# Altium schematic sheet TM1637_display.SchDoc
size A4
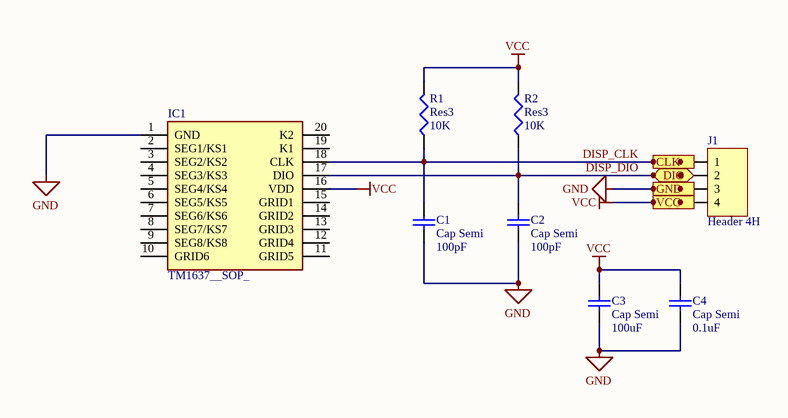
[diagram p0: TM1637_display.SchDoc]

## Parts
C1  Cap Semi  value 100pF  [1608[0603]]
C2  Cap Semi  value 100pF  [1608[0603]]
C3  Cap Semi  value 100uF  [1608[0603]]
C4  Cap Semi  value 0.1uF  [1608[0603]]
IC1  TM1637__SOP_  [SOIC127P1045X280-20N]
J1  Header 4H  [HDR1X4H]
R1  Res3  value 10K  [J1-0603]
R2  Res3  value 10K  [J1-0603]

## Ports
CLK (in), DIO (bidir), GND, VCC

## Nets
GND: C1.1 C2.1 C3.1 C4.1 IC1.1(GND) J1.3 ; port GND
VCC: C3.2 C4.2 IC1.16(VDD) J1.4 R1.2 R2.2 ; port VCC
DISP_CLK: C1.2 IC1.18(CLK) J1.1 R1.1 ; port CLK
DISP_DIO: C2.2 IC1.17(DIO) J1.2 R2.1 ; port DIO

Not connected (* = marked no-connect by the designer): IC1 2(SEG1/KS1) 3(SEG2/KS2) 4(SEG3/KS3) 5(SEG4/KS4) 6(SEG5/KS5) 7(SEG6/KS6) 8(SEG7/KS7) 9(SEG8/KS8) 10(GRID6) 11(GRID5) 12(GRID4) 13(GRID3) 14(GRID2) 15(GRID1) 19(K1) 20(K2)

## Library data of the parts
C1-C4 = Cap Semi: Capacitor (Semiconductor SIM Model); Published: 8-Jun-2000; LatestRevisionDate: 29-May-2009; LatestRevisionNote: IPC-7351 Footprint Added.; PackageReference: C1206; Publisher: Altium Limited; PackageDescription: Chip Capacitor
IC1 = TM1637__SOP_: Integrated Circuit; Manufacturer_Name: TITAN MICRO ELECTRONICS; Manufacturer_Part_Number: TM1637 (SOP); Datasheet Link: https://www.mcielectronics.cl/website_MCI/static/documents/Datasheet_TM1637.pdf; Height: 2.8mm
J1 = Header 4H: Header, 4-Pin, Right Angle; LatestRevisionDate: 17-Jul-2002; LatestRevisionNote: Re-released for DXP Platform.; Publisher: Altium Limited
R1 R2 = Res3: Resistor; Published: 8-Jun-2000; LatestRevisionDate: 29-May-2009; LatestRevisionNote: IPC-7351 Footprint Added.; PackageReference: J1-0603; Publisher: Altium Limited; PackageDescription: Chip Resistor